# Altium schematic sheet Power.SchDoc
size A4
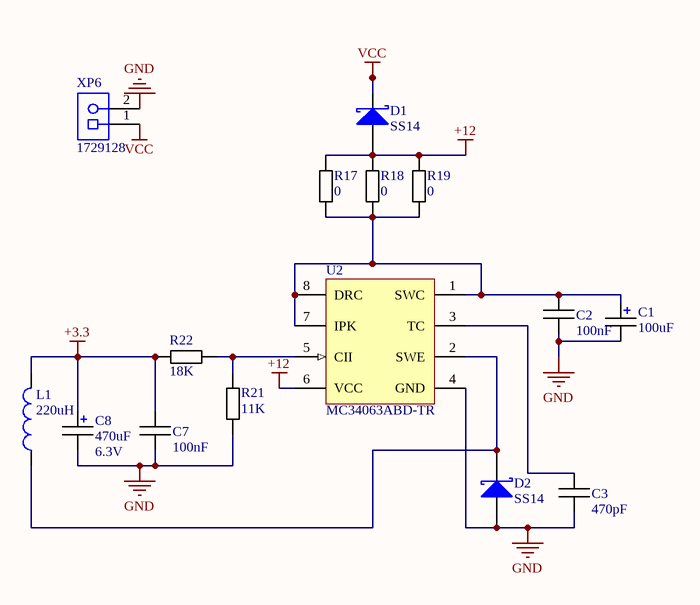
[diagram p0: Power.SchDoc]

## Parts
C1  Val: 100uF  [ECAP_SMD_6.3mmx5.4mm]  (hidden comment: CAP_ELEC_SMD)
C2  Val: 100nF  [CAPC1206(3216)170_L]  (hidden comment: CAP_SMD)
C3  Val: 470pF  [CAPC1206(3216)170_L]  (hidden comment: CAP_SMD)
C7  Val: 100nF  [CAPC1206(3216)170_L]  (hidden comment: CAP_SMD)
C8  Rated Capacitance: 470uF  Rated Voltage: 6.3V  [ECAP_SMD_8mmx10mm]  (hidden comment: CAP_ELEC_SMD)
D1  SS14  [DO-214]
D2  SS14  [DO-214]
L1  220uH  [SDR1006_SMD]
R17  Val: 0  [RESC1206(3216)_L]  (hidden comment: RES_SMD)
R18  Val: 0  [RESC1206(3216)_L]  (hidden comment: RES_SMD)
R19  Val: 0  [RESC1206(3216)_L]  (hidden comment: RES_SMD)
R21  Val: 11K  [RESC1206(3216)_L]  (hidden comment: RES_SMD)
R22  Val: 18K  [RESC1206(3216)_L]  (hidden comment: RES_SMD)
U2  MC34063ABD-TR  [SO-8_M]
XP6  1729128  [PHOE-1729128-2_V]

## Nets
+3.3: C7.2 C8.1 L1.2 R22.2
+12: D1.2(A) R17.2 R18.2 R19.2 U2.6(VCC)
GND: C1.2 C2.1 C3.1 C7.1 C8.2 D2.2(A) R21.2 U2.4(GND) XP6.2
VCC: D1.1(K) XP6.1
NetC1_1: C1.1 C2.2 R17.1 R18.1 R19.1 U2.1(SWC) U2.7(IPK) U2.8(DRC)
NetC3_2: C3.2 U2.3(TC)
NetD2_1: D2.1(K) L1.1 U2.2(SWE)
NetR21_1: R21.1 R22.1 U2.5(CII)

## Library data of the parts
C2 C3 C7 = CAP_SMD: Ceramic capacitor, 0805
D1 D2 = SS14: Schottky Rectifier, 1.1 W, -65 to 125 degC, 2-Pin SMD, RoHS, Tape and Reel; Manufacturer: Fairchild; Configuration: SINGLE; Diode Element Material: SILICON; Power Dissipation Limit-Max (W): 1.1; Additional Feature: FREEWHEELINGDIODE; Signal Diode Type: SIGNALDIODE; Number of Elements: 1; JEDEC-95 Code: DO-214AC; Rep Pk Reverse Voltage-Max (V): 40; Package Body Material: PLASTIC/EPOXY; CAGE Code: 1HBD3,07933,59621,7D893; Peak Reflow Temperature (Cel): 260; Package Shape: RECTANGULAR; Manufacturer URL: https://www.fairchildsemi.com/; JESD-97 Code: e3; Package Reference: DO-214AC-2; RoHS Compliant: YES; Package Description: 2-Pin Surface Mount Device, Body 4.375 x 2.725 mm; Technology: SCHOTTKY; Surface Mount: YES; Datasheet URL: http://www.onlinecomponents.com/datasheet/ss14.aspx?p=11369800; Terminal Form: CBEND; Package Style: SMALLOUTLINE; Number of Terminals: 2; JESD-30 Code: R-PDSO-C2; Average Forward Current-Max (A): 1; Terminal Finish: MATTETIN; Datasheet Version: Oct-13; Terminal Position: DUAL; Package URL: https://www.fairchildsemi.com/package-drawings/DO/DO214AC.pdf; Moisture Sensitivity Level: 1; Lead Free: YES
L1 = Inductor power: Inductor for Power Circuits; Manufacturer: TDK; Online Catalog: VLCFSeries; Catalog Drawings: VLCF50[20,20-(1,3),28-2]SeriesTopVLCF50[20,20-(1,3),28-2]SeriesFootprintVLCF50[20,20-(1,3)]SeriesSide; Current - Saturation: 2.62A; Frequency - Test: 100kHz; EDA / CAD Models: DownloadfromAcceleratedDesigns; Material - Core: Ferrite; Type: Wirewound; DC Resistance (DCR): 43mOhmMax; Inductance: 2.2µH; Tolerance: ±30%; Shielding: Shielded; Other Names: 445-4557-1; Size / Dimension: 0.197"Lx0.197"W(5.00mmx5.00mm); Datasheet Version: 04/2016; Package Description: 2-Pin Surface Mount Device, Body 5 x 5 mm; Package Reference: VLCF5020T-3; Package / Case: Nonstandard; Series: VLCF; Current Rating: 2.62A; Manufacturer URL: http://www.tdk.com/; Category: Inductors,Coils,Chokes; Height - Seated (Max): 0.079"(2.00mm); Mounting Technology: SurfaceMount; Family: FixedInductors; Datasheet URL: https://product.tdk.com/info/en/catalog/datasheets/inductor_commercial_power_vlcf5020-3_en.pdf; Standard Package: 1; Mounting Type: SurfaceMount; Operating Temperature: -40°C~105°C; Packaging: CutTape(CT)
R17-R19 R21 R22 = RES_SMD: RES0805
U2 = MC34063A: DC/DC converter control circuit, 8-Pin SO, Tape and Reel; PackageReference: SO8; DatasheetVersion: Nov-2007; PackageDescription: 8-Pin Small Outline Integrated Circuit 1.27 mm Pitch; ComponentLink3URL: http://www.st.com/internet/com/TECHNICAL_RESOURCES/TECHNICAL_LITERATURE/PACKAGE_INFORMATION/CD00004680.pdf; ComponentLink2Description: Datasheet; PackageVersion: Dec-2002; ComponentLink1URL: http://www.st.com; ComponentLink2URL: http://www.st.com/internet/com/TECHNICAL_RESOURCES/TECHNICAL_LITERATURE/DATASHEET/CD00001232.pdf; ComponentLink1Description: Manufacturer URL; ComponentLink3Description: Package Specification; Code_IPC: SOIC127P600-8; Code_JEDEC: MS-012-AA
XP6 = Terminal_2_Green: PCB Terminal Block, 13.5 A, 400 V, 2-Pin THD, RoHS, Bulk; Manufacturer: Phoenix Contact; Package Version: 03/2015; No. of Rows: 1; Pitch: 5.08mm; No. of Positions: 2; Voltage Rating: 400V; Current Rating: 13500mA; Manufacturer URL: http://www.phoenixcontact.com/; Datasheet URL: https://datasheet.ciiva.com/16046/1729128-16046181.pdf; RoHS: TRUE; Package URL: https://www.phoenixcontact.com/online/portal/pi/pxc/product_detail_page/!ut/p/b1/3VdJjqNKFDxLH8AFycySyWY2ozFsEPOMMQaDOX1XedGL_1Vdm5YXJleknhSKeBkvI6EA8ncAo3AYoDhBQGco6KN7VURTdemj9us_IEKEZo_YHiPAEWEFmDGOHMORkqKYCORBZxgL7ZoaZYcbFFUZ3fqxSY6GOuxydWUuHqz1ynmMFygu583Bob0Ewr6Sd_l-5m-kAueHiB0jpRwZwe58wwtkpxtMYd_LmGcDRU02dRNEyWt6Y2ti5pSyJ_reIkzIulrqApdnbT11V5jnCKbYNCvhEM1MCpPByat_X379-iThf08CI5GfOPqfBeS3BRoBOdD55AKVv0iLwCMq-2BrzXWSGRH7pUGD9uwXQjiph3xL0DKQwdGa0JImiIOmBNOestqgwTHSSs2oOep-78apyXQBvNi8ZLaFjvjWvcaUEBu0MC6Wbe-d6mB0FAebo2lUWinqYaZs5DAYzV0RP9yitUjnGJ0iI9xhZkT42OCQNUJJhkgWINNQLP2JFP6OpMg3JCVg70jqHT0lvKOnhHf0lPuOnnLf0VPuWx6_dxwUIvwk5WMkT0kLL1mh61l2yZVSzG3pYV_bqo-mj6uMKwKwdnnW8Jh5RTOJzMOA5c-eJDaZQw4mTMPH02PvS_ZAqNVjVTo2WyYLkwH_KU1mmmG5kjRhDqPXLwwVHvVOjCM60-fpXvTDfMGW1PVFVS1r4e4yVDk4ZdNbkUHvqPqQSeian4UD39fNKmachqdJ1NJbyk8rXT9mXTvPk3oE5meulKGgiruPJek-4I9hTT6G8ZLOyRSm2RRVbThERQad5OS28hdt4YW4vG0stgYYzsWsK4_7y6DZMjJSCqri1kyiZR5vD7pwIrNR7QwPHTcLTI5qT7eRlpHrdGiupYlqQDJ7zy_CND8fWWBoLRXxk1RVcXiBQwbTD4Xi7KL-FuO94t9xaqweXzH; PartNumber: 1729128; Package Description: 2-Pin Through Hole Device, Body 8.1 x 10.16 mm, Pitch 5.08 mm; Datasheet Version: 12/2013; Mounting Technology: ThroughHole; Orientation: Horizontal; Package Reference: 1729128-2; Packing: Bulk